# EAGLE design LightStickButton (EAGLE 7.7.0)
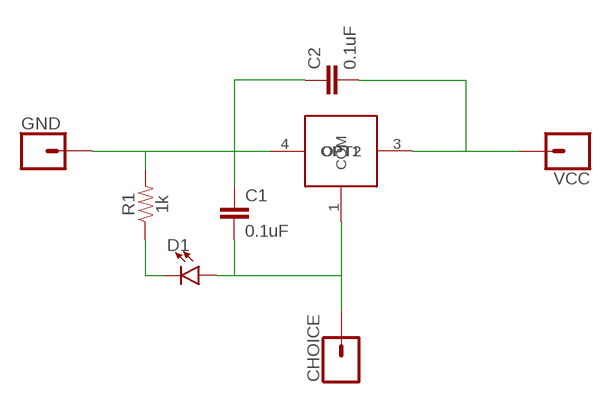
[diagram p0: schematic, sheet 1]

## Parts
B1  KS12R22CQD  [KS12R22CQD]
C1  0.1uF  0.1UF-0603-25V-5%  [0603]
C2  0.1uF  0.1UF-0603-25V-5%  [0603]
CHOICE  CONN_01  [1X01]
D1  LED0603  [LED-0603]
GND  CONN_01  [1X01]
R1  1k  1KOHM-0603-1/10W-1%  [0603]
VCC  CONN_01  [1X01]

## Nets
N$1: B1.4(OPT2) C1.1 C2.1 GND.1 R1.2
N$2: B1.3(OPT1) C2.2 VCC.1
N$3: B1.1(COM) C1.2 CHOICE.1 D1.A
N$5: D1.C R1.1

## Library data of the parts
B1 = freddyLibr:KS12R22CQD
C1 C2 = SparkFun-Capacitors:0.1UF: 0.1µF ceramic capacitors A capacitor is a passive two-terminal electrical component used to store electrical energy temporarily in an electric field.; PROD_ID: CAP-08604
CHOICE GND VCC = SparkFun-Connectors:CONN_01: Single connection point. Often used as Generic Header-pin footprint for 0.1 inch spaced/style header connections On any of the 0.1 inch spaced packages, you can populate with these: Break Away Headers - Straight <https://www.sparkfun.com/products/116> (PRT-00116) Break Away Male Headers - Right Angle <https://www.sparkfun.com/products/553> (PRT-00553) Female Headers <https://www.sparkfun.com/products/115> (PRT-00115) Break Away Headers - Machine Pin <https://www.sparkfun.com/products/117> (PRT-00117) Break Away Female Headers - Swiss Machine Pin <https://www.sparkfun.com/products/743> (PRT-00743) This device is also useful as a general connection point to wire up your design to another part of your project. Our various solder wires solder well into these plated through hole pads. Hook-Up Wire - Assortment (Stranded, 22 AWG) <https://www.sparkfun.com/products/11375> (PRT-11375) Hook-Up Wire - Assortment (Solid Core, 22 AWG) <https://www.sparkfun.com/products/11367> (PRT-11367) View the entire wire category on our website here <https://www.sparkfun.com/categories/141> Special notes: SMTSO-256-ET is a "flush mount" nut for a 4-40 screw. We mostly use this on specialty testbeds; it is a nice way to connect hardware to your PCB at an adjustable hieght. Also note, the SNAP packages are for using a snappable style connector. We sell a baggie of snaps and they are also used on two LilyPad designs: Snap Assortment - 30 pack (male and female) <https://www.sparkfun.com/products/11347> (DEV-11347) LilyPad Arduino SimpleSnap <https://www.sparkfun.com/products/10941> (DEV-10941) LilyPad SimpleSnap Protoboard <https://www.sparkfun.com/products/10940> (DEV-10940)
D1 = SparkFun-LED:LED: LED (Generic) Standard schematic elements and footprints for 5mm, 3mm, 1206, and 0603 sized LEDs. Generic LEDs with no color specified.
R1 = SparkFun-Resistors:1KOHM: 1kΩ resistor A resistor is a passive two-terminal electrical component that implements electrical resistance as a circuit element. Resistors act to reduce current flow, and, at the same time, act to lower voltage levels within circuits. - Wikipedia; PROD_ID: RES-07856

## Board
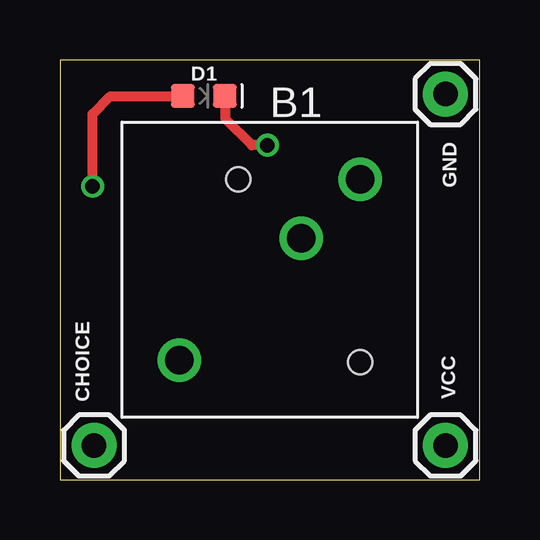
[diagram p1: board, top side]
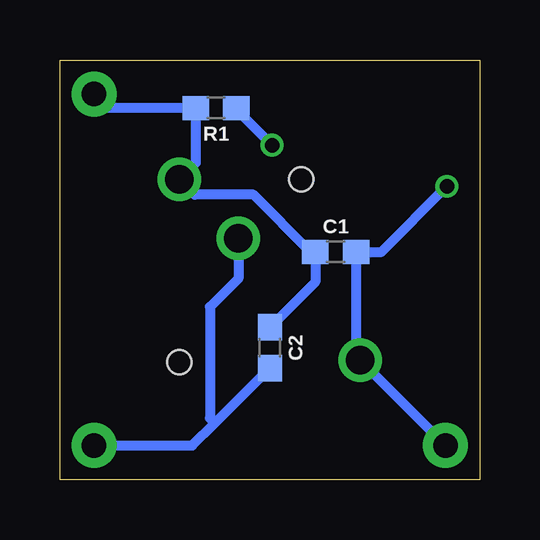
[diagram p2: board, bottom side, seen from below]

Size 17.5 x 17.5 mm. Coordinates in mm from the lower left corner, seen from the top.
Outline: 0,0 17.5,0 17.5,17.5 0,17.5 0,0
Copper layers (1*16): Top 0.0356mm / dielectric 1.5011mm / Bottom 0.0356mm
Design rules "LaenPCBOrder": minimum track width 6mil, minimum drill 13mil, track to track 6mil, track to pad 6mil, pad to pad 6mil, via to via 6mil, smd to smd 6mil, copper to edge 15mil, drill to drill 6mil, minimum pad ring 7mil, minimum via ring 7mil, stop-mask expansion 3mil, vias tented up to drill 0mil, thermal gap 10mil

### Footprints (pad centres in the part's own frame; a part is rotated, then mirrored left to right if it is on the bottom)
KS12R22CQD = drill 1.2 pad 1.27: 1 -3.77,-3.77; 3 1.31,1.31; 4 3.77,3.77 | hole 1: -1.31,3.77; 3.77,-3.85
0603 = smd 1.1 x 1: 1 -0.85,0; 2 0.85,0
1X01 = drill 1.016 pad 1.88: 1 0,0
LED-0603 = smd 1 x 1: A -0.877,0; C 0.877,0

### Placement (x,y rotation side)
B1  8.75,8.75 0 top
C1  6,9.5 0 bottom
C2  8.75,5.5 270 bottom
CHOICE  1.42,1.42 0 top
D1  6,16 0 top
GND  16.08,16.08 0 top
R1  10.99,15.5 180 bottom
VCC  16.08,1.42 0 top

### Tracks (layer width: path | path; a pad name or v marks a point on that pad's centre or on a via)
N$1
  Bottom 0.406: GND.1 15.5,15.5 R1.2 11.84,13.2 B1.4 11.88,11.88 9.43,11.88 7.05,9.5 C1.1 6.85,8.25 C2.1
N$2
  Bottom 0.406: VCC.1 11.98,1.42 11.04,2.36 | 11.04,2.36 C2.2 | B1.3 10.06,8.38 11.24,7.2 11.24,2.56 11.04,2.36
N$3  (via drill 0.6)
  Top 0.406: v1.36,12.23 1.36,15.24 2.1,15.98 5.1,15.98 D1.A
  Bottom 0.406: CHOICE.1 B1.1 5.15,5.15 C1.2 4.09,9.5 v1.36,12.23
N$5  (via drill 0.6)
  Top 0.406: v8.65,13.94 8.01,13.94 6.91,15.04 6.91,15.97 D1.C
  Bottom 0.406: R1.1 10.14,15.43 v8.65,13.94